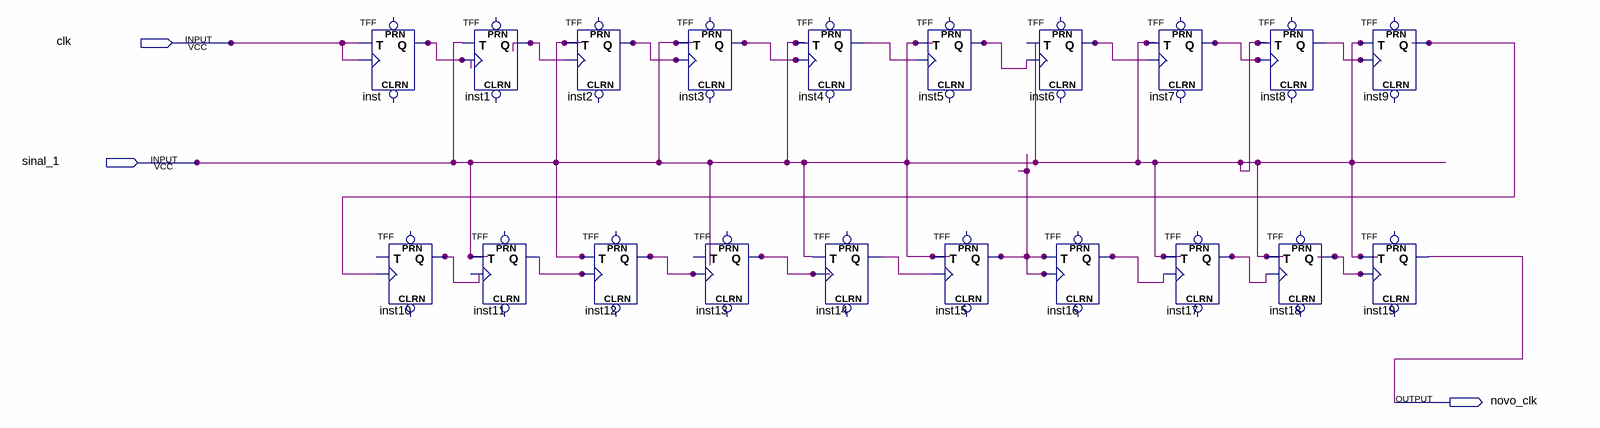
[diagram p0: schematic sheet]
// Quartus schematic redutor.bdf as structural Verilog: 20 symbols, 3 pins
module redutor (
  input  clk,
  input  sinal_1,
  output novo_clk
);

  wire inst1_q, inst2_q, inst3_q, inst4_q, inst5_q, inst6_q, inst7_q, inst8_q, inst9_q, inst10_q, inst11_q,
       inst12_q, inst13_q, inst14_q, inst15_q, inst16_q, inst17_q, inst18_q, inst_q, undriven;

  TFF inst (.T(clk), .CLK(clk), .Q(inst_q));  // open: PRN, CLRN
  TFF inst10 (.CLK(inst9_q), .Q(inst10_q));  // open: PRN, CLRN, T
  TFF inst1 (.T(sinal_1), .CLK(inst_q), .Q(inst1_q));  // open: PRN, CLRN
  TFF inst11 (.T(sinal_1), .Q(inst11_q));  // open: PRN, CLRN, CLK
  TFF inst2 (.T(sinal_1), .CLK(inst1_q), .Q(inst2_q));  // open: PRN, CLRN
  TFF inst12 (.T(sinal_1), .CLK(inst11_q), .Q(inst12_q));  // open: PRN, CLRN
  TFF inst3 (.T(sinal_1), .CLK(inst2_q), .Q(inst3_q));  // open: PRN, CLRN
  TFF inst13 (.T(undriven), .CLK(inst12_q), .Q(inst13_q));  // open: PRN, CLRN
  TFF inst4 (.T(sinal_1), .CLK(inst3_q), .Q(inst4_q));  // open: PRN, CLRN
  TFF inst14 (.T(sinal_1), .CLK(inst13_q), .Q(inst14_q));  // open: PRN, CLRN
  TFF inst5 (.T(sinal_1), .CLK(inst4_q), .Q(inst5_q));  // open: PRN, CLRN
  TFF inst15 (.T(sinal_1), .CLK(inst14_q), .Q(inst15_q));  // open: PRN, CLRN
  TFF inst6 (.T(sinal_1), .CLK(inst5_q), .Q(inst6_q));  // open: PRN, CLRN
  TFF inst16 (.T(inst15_q), .CLK(inst15_q), .Q(inst16_q));  // open: PRN, CLRN
  TFF inst7 (.T(sinal_1), .CLK(inst6_q), .Q(inst7_q));  // open: PRN, CLRN
  TFF inst17 (.T(sinal_1), .CLK(inst16_q), .Q(inst17_q));  // open: PRN, CLRN
  TFF inst8 (.T(sinal_1), .CLK(inst7_q), .Q(inst8_q));  // open: PRN, CLRN
  TFF inst18 (.T(sinal_1), .CLK(inst17_q), .Q(inst18_q));  // open: PRN, CLRN
  TFF inst9 (.T(sinal_1), .CLK(inst8_q), .Q(inst9_q));  // open: PRN, CLRN
  TFF inst19 (.T(sinal_1), .CLK(inst18_q), .Q(novo_clk));  // open: PRN, CLRN
endmodule
